# Altium schematic sheet TIDA-01485_Page2.SchDoc
size 431 x 279 mm; Date: Not shown in title block; ApprovedBy: Not shown in title block; CheckedBy: Not shown in title block; Author: Not shown in title block; CompanyName: Not shown in title block; DrawnBy: Manu; Engineer: Not shown in title block; Organization: Not shown in title block; Address1: Not shown in title block; Address2: Not shown in title block; Address3: Not shown in title block; Address4: Not shown in title block; DocumentNumber: 1; Revision: Use project parameter SCH_Rev; SheetNumber: 3; SheetTotal: 5; PageSetup: Record=PageOptions|CenterHorizontal=True|CenterVertical=True|PrintScale=1.00|XCorrection=1.00|YCorrection=1.00|PrintKind=0|BorderSize=5000000|LeftOffset=0|BottomOffset=0|Orientation=2|PaperLength=1000|PaperWidth=1000|Scale=100|PaperSource=15|PrintQuality=600|MediaType=1|DitherType=10|PaperKind=Letter|PrintScaleMode=1; CurrentTime: Not shown in title block; CurrentDate: Not shown in title block; Time: Not shown in title block; DocumentFullPathAndName: Not shown in title block; DocumentName: Not shown in title block; ModifiedDate: Not shown in title block; ImagePath: Not shown in title block
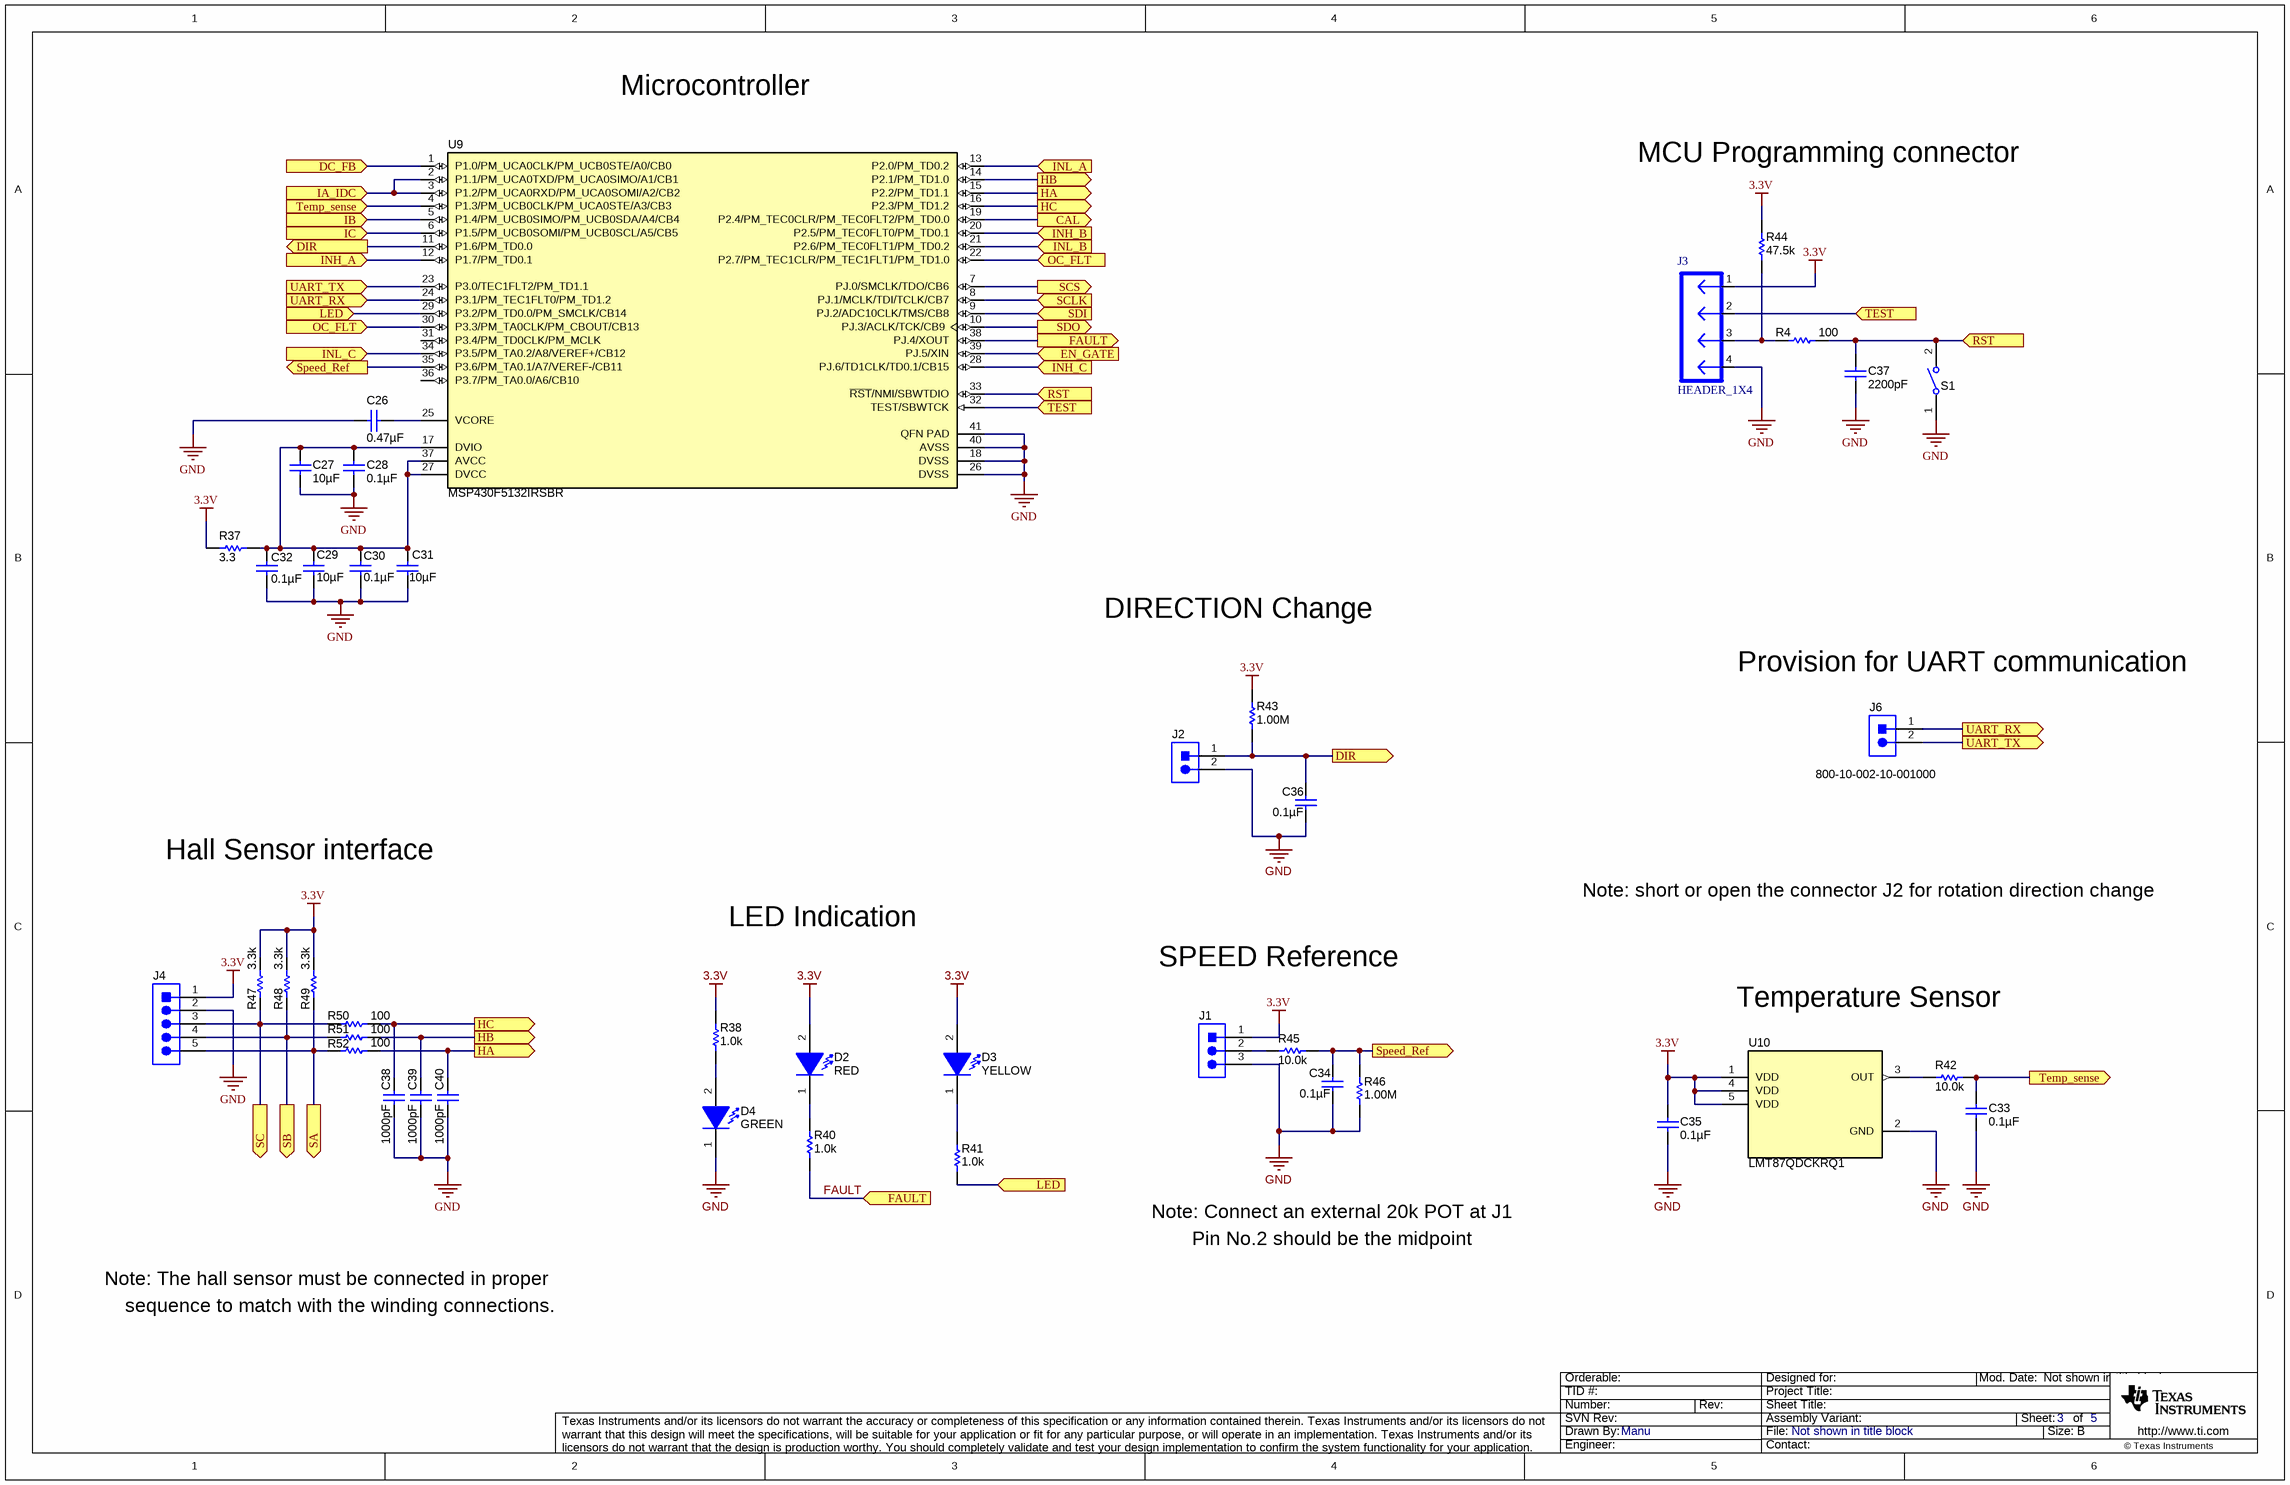
[diagram p0: TIDA-01485_Page2.SchDoc]

## Parts
C26  ValueDisplayed: 0.47µF  [0805_HV]  (hidden comment: C0805C474K4RACTU)
C27  ValueDisplayed: 10µF  [0805_HV]  (hidden comment: 0805YD106MAT2A)
C28  ValueDisplayed: 0.1µF  [0603]  (hidden comment: 0603YC104JAT2A)
C29  ValueDisplayed: 10µF  [0805_HV]  (hidden comment: 0805YD106MAT2A)
C30  ValueDisplayed: 0.1µF  [0603]  (hidden comment: 0603YC104JAT2A)
C31  ValueDisplayed: 10µF  [0805_HV]  (hidden comment: 0805YD106MAT2A)
C32  ValueDisplayed: 0.1µF  [0603]  (hidden comment: 0603YC104JAT2A)
C33  ValueDisplayed: 0.1µF  [0402]  (hidden comment: 885012105016)
C34  ValueDisplayed: 0.1µF  [0402]  (hidden comment: 885012105016)
C35  ValueDisplayed: 0.1µF  [0402]  (hidden comment: 885012105016)
C36  ValueDisplayed: 0.1µF  [0402]  (hidden comment: 885012105016)
C37  ValueDisplayed: 2200pF  [0402]  (hidden comment: GRM155R71H222KA01D)
C38  ValueDisplayed: 1000pF  [0402]  (hidden comment: 885012205061)
C39  ValueDisplayed: 1000pF  [0402]  (hidden comment: 885012205061)
C40  ValueDisplayed: 1000pF  [0402]  (hidden comment: 885012205061)
D2  value RED  [WL-SMCW_GREEN]  (hidden comment: 150060GS75000)
D3  value YELLOW  [WL-SMCW_GREEN]  (hidden comment: 150060GS75000)
D4  value GREEN  [WL-SMCW_GREEN]  (hidden comment: 150060GS75000)
J1  800-10-003-10-001000  [Mill-Max_800-10-003-10-001000]  (value not drawn)
J2  800-10-002-10-001000  [Mill-Max_800-10-002-10-001000]  (value not drawn)
J3  HEADER_1X4  [Mill-Max_800-10-004-10-001000]
J4  800-10-005-10-001000  [Mill-Max_800-10-005-10-001000]  (value not drawn)
J6  800-10-002-10-001000  [Mill-Max_800-10-002-10-001000]
R4  ValueDisplayed: 100  [0402]  (hidden comment: ERJ-2RKF1000X)
R37  ValueDisplayed: 3.3  [0603]  (hidden comment: CRCW06033R30JNEA)
R38  ValueDisplayed: 1.0k  [0603]  (hidden comment: CRCW06031K00JNEA)
R40  ValueDisplayed: 1.0k  [0603]  (hidden comment: CRCW06031K00JNEA)
R41  ValueDisplayed: 1.0k  [0603]  (hidden comment: CRCW06031K00JNEA)
R42  ValueDisplayed: 10.0k  [0402]  (hidden comment: CRCW040210K0FKED)
R43  ValueDisplayed: 1.00M  [0402]  (hidden comment: ERJ-2RKF1004X)
R44  ValueDisplayed: 47.5k  [0402]  (hidden comment: CRCW040247K5FKED)
R45  ValueDisplayed: 10.0k  [0402]  (hidden comment: CRCW040210K0FKED)
R46  ValueDisplayed: 1.00M  [0402]  (hidden comment: ERJ-2RKF1004X)
R47  ValueDisplayed: 3.3k  [0402]  (hidden comment: CRCW04023K30JNED)
R48  ValueDisplayed: 3.3k  [0402]  (hidden comment: CRCW04023K30JNED)
R49  ValueDisplayed: 3.3k  [0402]  (hidden comment: CRCW04023K30JNED)
R50  ValueDisplayed: 100  [0402]  (hidden comment: ERJ-2RKF1000X)
R51  ValueDisplayed: 100  [0402]  (hidden comment: ERJ-2RKF1000X)
R52  ValueDisplayed: 100  [0402]  (hidden comment: ERJ-2RKF1000X)
S1  434121025816  [SW_434121025816]  (value not drawn)
U9  MSP430F5132IRSBR  [RSB0040B]
U10  LMT87QDCKRQ1  [DCK0005A_N]

## Ports
CAL (out), DC_FB (in), DIR (out), EN_GATE (in), FAULT (in), FAULT (out), HA (out), HB (out), HC (out), IA_IDC (in), IB (in), IC (in), INH_A (in), INH_B (in), INH_C (in), INL_A (in), INL_B (in), INL_C (in), LED (in), OC_FLT (in), RST (in), SA (out), SB (out), SC (out), SCLK (in), SCS (out), SDI (in), SDO (out), Speed_Ref (out), Temp_sense (in), Temp_sense (out), TEST (in), UART_RX (in), UART_RX (out), UART_TX (in), UART_TX (out)

## Nets
3.3V: C35.1 D2.2(A) D3.2(A) J1.1 J3.1 J4.1 R37.1 R38.2 R43.1 R44.2 R47.2 R48.2 R49.2 U10.1(VDD) U10.4(VDD) U10.5(VDD)
GND: C26.2 C27.2 C28.2 C29.2 C30.2 C31.2 C32.2 C33.2 C34.2 C35.2 C36.2 C37.2 C38.2 C39.2 C40.2 D4.1(K) J1.3 J2.2 J3.4 J4.2 R46.1 S1.1 U9.18(DVSS) U9.26(DVSS) U9.40(AVSS) U9.41(QFN_PAD) U10.2(GND)
CAL: U9.19(P2.4/PM_TEC0CLR/PM_TEC0FLT2/PM_TD0.0) ; port CAL
DC_FB: U9.1(P1.0/PM_UCA0CLK/PM_UCB0STE/A0/CB0) ; port DC_FB
DIR: C36.1 J2.1 R43.2 U9.11(P1.6/PM_TD0.0) ; port DIR
EN_GATE: U9.39(PJ.5/XIN) ; port EN_GATE
FAULT: R40.1 U9.38(PJ.4/XOUT) ; port FAULT
HA: C40.1 R52.1 U9.15(P2.2/PM_TD1.1) ; port HA
HB: C39.1 R51.1 U9.14(P2.1/PM_TD1.0) ; port HB
HC: C38.1 R50.1 U9.16(P2.3/PM_TD1.2) ; port HC
IA_IDC: U9.2(P1.1/PM_UCA0TXD/PM_UCA0SIMO/A1/CB1) U9.3(P1.2/PM_UCA0RXD/PM_UCA0SOMI/A2/CB2) ; port IA_IDC
IB: U9.5(P1.4/PM_UCB0SIMO/PM_UCB0SDA/A4/CB4) ; port IB
IC: U9.6(P1.5/PM_UCB0SOMI/PM_UCB0SCL/A5/CB5) ; port IC
INH_A: U9.12(P1.7/PM_TD0.1) ; port INH_A
INH_B: U9.20(P2.5/PM_TEC0FLT0/PM_TD0.1) ; port INH_B
INH_C: U9.28(PJ.6/TD1CLK/TD0.1/CB15) ; port INH_C
INL_A: U9.13(P2.0/PM_TD0.2) ; port INL_A
INL_B: U9.21(P2.6/PM_TEC0FLT1/PM_TD0.2) ; port INL_B
INL_C: U9.34(P3.5/PM_TA0.2/A8/VEREF+/CB12) ; port INL_C
LED: R41.1 U9.29(P3.2/PM_TD0.0/PM_SMCLK/CB14) ; port LED
OC_FLT: U9.22(P2.7/PM_TEC1CLR/PM_TEC1FLT1/PM_TD1.0) U9.30(P3.3/PM_TA0CLK/PM_CBOUT/CB13) ; port OC_FLT
RST: C37.1 R4.1 S1.2 U9.33(~{RST}/NMI/SBWTDIO) ; port RST
SA: J4.5 R49.1 R52.2 ; port SA
SB: J4.4 R48.1 R51.2 ; port SB
SC: J4.3 R47.1 R50.2 ; port SC
SCLK: U9.8(PJ.1/MCLK/TDI/TCLK/CB7) ; port SCLK
SCS: U9.7(PJ.0/SMCLK/TDO/CB6) ; port SCS
SDI: U9.9(PJ.2/ADC10CLK/TMS/CB8) ; port SDI
SDO: U9.10(PJ.3/ACLK/TCK/CB9) ; port SDO
Speed_Ref: C34.1 R45.1 R46.2 U9.35(P3.6/PM_TA0.1/A7/VEREF-/CB11) ; port Speed_Ref
Temp_sense: C33.1 R42.1 U9.4(P1.3/PM_UCB0CLK/PM_UCA0STE/A3/CB3) ; port Temp_sense
TEST: J3.2 U9.32(TEST/SBWTCK) ; port TEST
UART_RX: J6.1 U9.24(P3.1/PM_TEC1FLT0/PM_TD1.2) ; port UART_RX
UART_TX: J6.2 U9.23(P3.0/TEC1FLT2/PM_TD1.1) ; port UART_TX
NetC26_1: C26.1 U9.25(VCORE)
NetC27_1: C27.1 C28.1 C29.1 C30.1 C31.1 C32.1 R37.2 U9.17(DVIO) U9.27(DVCC) U9.37(AVCC)
NetD2_1: D2.1(K) R40.2
NetD3_1: D3.1(K) R41.2
NetD4_2: D4.2(A) R38.1
NetJ1_2: J1.2 R45.2
NetJ3_3: J3.3 R4.2 R44.1
NetR42_2: R42.2 U10.3(OUT)

Not connected (* = marked no-connect by the designer): U9 31(P3.4/PM_TD0CLK/PM_MCLK) 36(P3.7/PM_TA0.0/A6/CB10)

## Notes on the sheet
- Microcontroller
- MCU Programming connector
- DIRECTION Change
- (near J6) Provision for UART communication
- Hall Sensor interface
- Note: short or open the connector J2 for rotation direction change
- LED Indication
- SPEED Reference
- Temperature Sensor
- Note: Connect an external 20k POT at J1
- Pin No.2 should be the midpoint
- Note: The hall sensor must be connected in proper
- sequence to match with the winding connections.
- Drawn By:
- SVN Rev:
- Number:
- TID #:
- Orderable:
- Rev:
- Sheet Title:
- File:
- Project Title:
- Designed for:
- Assembly Variant:
- Mod. Date:
- Sheet:
- Size:
- of
- B
- http://www.ti.com
- Texas Instruments and/or its licensors do not warrant the accuracy or completeness of this specification or any information contained therein. Texas Instruments and/or its licensors do not warrant that this design will meet the specifications, will be suitable for your application or fit for any particular purpose, or will operate in an implementation. Texas Instruments and/or its licensors do not warrant that the design is production worthy. You should completely validate and test your design implementation to confirm the system functionality for your application.
- Engineer:
- Contact:
- © Texas Instruments

## Library data of the parts
C26 = C0805C474K4RACTU: CAP, CERM, 0.47 µF, 16 V, +/- 10%, X7R, 0805; Manufacturer: Kemet; Polarized: N; CompType: Capacitor; Value: 0.47uF; U/M: EA; Cap_F: 0.00000047; Tolerance_%: 10; Value1: Unknown; VDC_V: 16; Value2: 16V; TaMin_C: -55; TaMax_C: 125; Cap_Case: 0805; SymbolVersion: 2008-07-09; PartNumber: C0805C474K4RACTU; PackageReference: 0805; RoHS: Y; MountType: SMT; Technology: Ceramic; TempCo: X7R; Published: 2008-06-19; Publisher: Texas Instruments; LatestRevisionDate: 2015-06-13; ComponentLink1Description: Datasheet link; ComponentLink1URL: http://www.kemet.com/docfinder?Partnumber=C0805C474K4RACTU; Supplier 1: Digi-Key; Supplier Part Number 1: 399-8099-1-ND; Supplier 2: Mouser; Supplier Part Number 2: 80-C0805C474K4R; Supplier 3: Farnell; Supplier Part Number 3: 1288279
C27 C29 C31 = 0805YD106MAT2A: CAP, CERM, 10uF, 16V, +/-20%, X5R, 0805; Manufacturer: AVX; Polarized: N; CompType: Capacitor; U/M: EA; Cap_F: 0.00001; Tolerance_%: 20; Value1: Unknown; VDC_V: 16; TaMin_C: -55; TaMax_C: 85; Cap_Case: 0805; SymbolVersion: 2008-07-09; Value: 10uF; PartNumber: 0805YD106MAT2A; PackageReference: 0805; RoHS: Y; Value2: 16V; MountType: SMT; Technology: Ceramic; TempCo: X5R; Published: 2008-06-19; Publisher: Texas Instruments; LatestRevisionDate: 2014-07-08; ComponentLink1Description: Datasheet link; ComponentLink1URL: http://www.avx.com/docs/Catalogs/cx5r.pdf; Supplier 1: Farnell; Supplier Part Number 1: 1582704
C28 C30 C32 = 0603YC104JAT2A: CAP, CERM, 0.1 µF, 16 V, +/- 5%, X7R, 0603; Manufacturer: AVX; Polarized: N; CompType: Capacitor; Value: 0.1uF; U/M: EA; Cap_F: 0.0000001; Tolerance_%: 5; ESR_ohm: 0.039; Value1: 0.039 ohm; VDC_V: 16; Value2: 16V; TaMin_C: -55; TaMax_C: 125; SymbolVersion: 2008-07-09; PartNumber: 0603YC104JAT2A; PackageReference: 0603; RoHS: Y; MountType: SMT; Technology: Ceramic; TempCo: X7R; Cap_Case: 0603; Published: 2008-06-19; Publisher: Texas Instruments; LatestRevisionDate: 2015-06-13; ComponentLink1Description: Datasheet link; ComponentLink1URL: http://www.avx.com/docs/masterpubs/smccp.pdf; Supplier 1: Digi-Key; Supplier Part Number 1: 478-3726-1-ND; Supplier 2: Mouser; Supplier Part Number 2: 581-0603YC104J; Supplier 3: Farnell; Supplier Part Number 3: 1740612
C33-C36 = 885012105016: CAP, CERM, 0.1 µF, 16 V, +/- 20%, X5R, 0402; Manufacturer: Wurth Elektronik; Polarized: N; CompType: Capacitor; Value: 0.1uF; U/M: EA; Cap_F: 0.0000001; Tolerance_%: 20; Value1: Unknown; VDC_V: 16; Value2: 16V; TaMin_C: -55; TaMax_C: 85; AEC Category: Q200; SymbolVersion: 2008-07-09; PartNumber: 885012105016; PackageReference: 0402; RoHS: Y; MountType: SMT; Technology: Ceramic; TempCo: X5R; Cap_Case: 0402; Published: 2008-06-19; Publisher: Texas Instruments; ComponentLink1Description: Datasheet link; ComponentLink1URL: http://katalog.we-online.de/pbs/datasheet/885012105016.pdf; Supplier 1: Mouser; Supplier Part Number 1: 710-885012105016; Supplier 2: Newark; Supplier Part Number 2: 40Y4445; AEC Qualified: N; AEC Grade: N/A
  C33 C34 C36: LatestRevisionDate: 2016-01-15
  C35: LatestRevisionDate: 2016-01-22
C37 = GRM155R71H222KA01D: CAP, CERM, 2200 pF, 50 V, +/- 10%, X7R, 0402; Manufacturer: MuRata; Polarized: N; CompType: Capacitor; Value: 2200pF; U/M: EA; Cap_F: 0.0000000022; Tolerance_%: 10; Value1: Unknown; VDC_V: 50; Value2: 50V; TaMin_C: -55; TaMax_C: 125; AEC Category: Q200; SymbolVersion: 2008-07-09; PartNumber: GRM155R71H222KA01D; PackageReference: 0402; RoHS: Y; MountType: SMT; Technology: Ceramic; TempCo: X7R; Cap_Case: 0402; Published: 2008-06-19; Publisher: Texas Instruments; LatestRevisionDate: 2016-01-08; ComponentLink1Description: Datasheet link; ComponentLink1URL: http://search.murata.co.jp/Ceramy/PnsearchViewAction.do?HnOFG=ON&HnNFG=ON&SEL_CNT=50&sLang=en&sKey=GRM155R71H222KA01D&x=9&y=9&search=startwith; Supplier 1: Digi-Key; Supplier Part Number 1: 490-1305-1-ND; Supplier 2: Mouser; Supplier Part Number 2: 81-GRM36X222K50; Supplier 3: Farnell; Supplier Part Number 3: 1828884; AEC Qualified: ?
C38-C40 = 885012205061: CAP, CERM, 1000 pF, 50 V, +/- 10%, X7R, 0402; Manufacturer: Wurth Elektronik; Polarized: N; CompType: Capacitor; Value: 1000pF; U/M: EA; Cap_F: 0.000000001; Tolerance_%: 10; Value1: Unknown; VDC_V: 50; Value2: 50V; TaMin_C: -55; TaMax_C: 125; AEC Category: Q200; SymbolVersion: 2008-07-09; PartNumber: 885012205061; PackageReference: 0402; RoHS: Y; MountType: SMT; Technology: Ceramic; TempCo: X7R; Cap_Case: 0402; Published: 2008-06-19; Publisher: Texas Instruments; LatestRevisionDate: 2016-01-30; ComponentLink1Description: Datasheet link; ComponentLink1URL: http://katalog.we-online.de/pbs/datasheet/885012205061.pdf; Supplier 1: Digi-Key; Supplier Part Number 1: 732-7556-1-ND; Supplier 2: Mouser; Supplier Part Number 2: 710-885012205061; AEC Qualified: N; AEC Grade: N/A
D2 = 150060GS75000: LED RED CLEAR 0603 SMD; Manufacturer: Wurth Elektronics Inc; PartNumber: 150060RS75000; Type: InGaN; Vf_V: 3.2; Value2: 2V; Io_A: 0.02; Tjmax_C: 85; Value1: W; Angle: 140; U/M: EA; CompType: LED; SymbolVersion: 2008-11-06; MountType: SMT; RoHS: Y; PackageReference: LED_0603; Color: Red; Published: 2008-07-11; Publisher: Texas Instruments; ComponentLink1URL: Visible Name Value Type    False ComponentLink1URL http://katalog.we-online.de/led/datasheet/150060GS75000.pdf STRING; ComponentLink1Description: Datasheet link; LatestRevisionDate: 2016-01-08; Supplier 1: Digi-Key; Supplier Part Number 1: 732-4978-1-ND; Supplier 2: Mouser; Supplier Part Number 2: 710-150060GS75000; Supplier 3: Farnell; Supplier Part Number 3: 2322070
D3 = 150060GS75000: LED YELLOW CLEAR 0603 SMD; Manufacturer: Wurth Elektronics Inc; PartNumber: 150060YS75000; Type: InGaN; Vf_V: 2V; Io_A: 0.02; Tjmax_C: 85; Value1: W; Angle: 140; U/M: EA; CompType: LED; SymbolVersion: 2008-11-06; MountType: SMT; RoHS: Y; PackageReference: LED_0603; Value2: 2V; Color: Yellow; Published: 2008-07-11; Publisher: Texas Instruments; ComponentLink1URL: http://katalog.we-online.de/led/datasheet/150060YS75000.pdf; ComponentLink1Description: Datasheet link; LatestRevisionDate: 2016-01-08; Supplier 1: Digi-Key; Supplier Part Number 1: 732-4981-1-ND; Supplier 2: Mouser; Supplier Part Number 2: 710-150060GS75000; Supplier 3: Farnell; Supplier Part Number 3: 2322070
D4 = 150060GS75000: LED, Green, SMD; Manufacturer: Wurth Elektronics Inc; Type: InGaN; Vf_V: 3.2; Value2: 3.2V; Io_A: 0.02; Tjmax_C: 85; Value1: W; Angle: 140; U/M: EA; CompType: LED; PartNumber: 150060GS75000; SymbolVersion: 2008-11-06; MountType: SMT; RoHS: Y; PackageReference: LED_0603; Color: Green; Published: 2008-07-11; Publisher: Texas Instruments; ComponentLink1URL: http://katalog.we-online.de/led/datasheet/150060GS75000.pdf; ComponentLink1Description: Datasheet link; LatestRevisionDate: 2016-01-08; Supplier 1: Digi-Key; Supplier Part Number 1: 732-4971-1-ND; Supplier 2: Mouser; Supplier Part Number 2: 710-150060GS75000; Supplier 3: Farnell; Supplier Part Number 3: 2322070
J1 = 800-10-003-10-001000: Header, 100mil, 3x1, TH; Manufacturer: Mill-Max; SymbolCreator: a0799628; U/M: EA; SymbolVersion: 2013-03-28; PartNumber: 800-10-003-10-001000; ClassName: Header; PackageReference: Header, 3x1, 100mil, TH; CompType: Header; RoHS: Y; MountType: TH; ComponentLink1Description: Datasheet Link; ComponentLink1URL: http://www.mill-max.com/assets/pdfs/054.PDF; Publisher: Texas Instruments; LatestRevisionDate: 2014-11-22; Supplier 1: Digi-Key; Supplier Part Number 1: ED7203-ND
J2 J6 = 800-10-002-10-001000: Header, 100mil, 2x1, TH; Manufacturer: Mill-Max; SymbolCreator: a0412235; U/M: EA; SymbolVersion: 2013-10-31; PartNumber: 800-10-002-10-001000; PackageReference: Header, 2x1, 100mil, TH; ClassName: Header; CompType: Header; RoHS: Y; MountType: TH; ComponentLink1Description: Datasheet Link; ComponentLink1URL: http://www.mill-max.com/assets/pdfs/054.PDF; Publisher: Texas Instruments; LatestRevisionDate: 2015-01-30; Supplier 1: Digi-Key; Supplier Part Number 1: ED7202-ND
J3 = HEADER_1X4: Header, Male 4-pin, 100mil spacing,; Manufacturer: Sullins; PartNumber: PEC04SAAN; area: 44000; Value: PEC04SAAN; ComponentLink1URL: \\vette02\pmp_pcb\pcad_pdf's\pec36saan.pdf; ComponentHeight: 0.330 inch; SymbolVersion: 05/14/2009 13:15:14; PackageReference: 0.100 inch x 4; ComponentLink1Description: AEO Datasheet Link
J4 = 800-10-005-10-001000: Header, 100mil, 5x1, TH; Manufacturer: Mill-Max; SymbolCreator: a0412235; SymbolVersion: 2013-12-22; PartNumber: 800-10-005-10-001000; PackageReference: Header, 5x1, 100mil, TH; ClassName: Header; CompType: Header; RoHS: Y; MountType: TH; ComponentLink1Description: Datasheet URL; ComponentLink1URL: http://www.mill-max.com/assets/pdfs/054.PDF; Publisher: Texas Instruments; LatestRevisionDate: 2015-12-15; Supplier 1: Digi-Key; Supplier Part Number 1: ED7205-ND
R4 R50-R52 = ERJ-2RKF1000X: RES, 100, 1%, 0.1 W, 0402; Manufacturer: Panasonic; CompType: Resistor; Value: 100; Value_Code: 100R; Tolerance_%: 1; Power_W: 0.1; Value2: 0.1W; VDC_V: 50; TempCo: 100 ppm/C; EIA_Code: E96; U/M: EA; AEC Category: Q200; SymbolVersion: 2009-05-29; PartNumber: ERJ-2RKF1000X; PackageReference: 0402; RoHS: Y; Res_ohm: 100; Value1: 1%; MountType: SMT; Technology: Thick Film; Published: 2008-06-26; Publisher: Texas Instruments; LatestRevisionDate: 2016-01-08; ComponentLink1Description: Datasheet link; ComponentLink1URL: http://industrial.panasonic.com/www-data/pdf/AOA0000/AOA0000CE2.pdf; Supplier 1: Digi-Key; Supplier Part Number 1: P100LCT-ND; Supplier 2: Mouser; Supplier Part Number 2: 667-ERJ-2RKF1000X; Supplier 3: Farnell; Supplier Part Number 3: 2304034; AEC Qualified: ?
R37 = CRCW06033R30JNEA: RES, 3.3, 5%, 0.1 W, 0603; Manufacturer: Vishay-Dale; CompType: Resistor; Value: 3.3; Value_Code: 3R30; Tolerance_%: 5; Power_W: 0.1; Value2: 0.1W; VDC_V: 75; TempCo: 200 ppm/C; EIA_Code: E24; U/M: EA; SizeArea_mm2: 1.28; SizeX_mm: 1.6; SizeY_mm: 0.8; SizeZ_mm: 1; AEC Category: Q200; SymbolVersion: 2009-05-29; PartNumber: CRCW06033R30JNEA; PackageReference: 0603; RoHS: Y; Res_ohm: 3.3; Value1: 5%; MountType: SMT; Technology: Thick Film; Published: 2008-06-26; Publisher: Texas Instruments; LatestRevisionDate: 2016-08-11; ComponentLink1Description: Datasheet link; ComponentLink1URL: http://www.vishay.com/docs/20035/dcrcwe3.pdf; Supplier 1: Digi-Key; Supplier Part Number 1: 541-3.3GCT-ND; Supplier 2: Mouser; Supplier Part Number 2: 71-CRCW0603J-3.3-E3; Supplier 3: Farnell; Supplier Part Number 3: 1514753; AEC Qualified: ?
R38 R40 R41 = CRCW06031K00JNEA: RES, 1.0 k, 5%, 0.1 W, 0603; Manufacturer: Vishay-Dale; CompType: Resistor; Value: 1.0k; Res_ohm: 1000; Value_Code: 1k00; Tolerance_%: 5; Power_W: 0.1; Value2: 0.1W; VDC_V: 75; TempCo: 200 ppm/C; EIA_Code: E24; U/M: EA; AEC Category: Q200; SizeArea_mm2: 1.28; SizeX_mm: 1.6; SizeY_mm: 0.8; SizeZ_mm: 1; SymbolVersion: 2009-05-29; PartNumber: CRCW06031K00JNEA; PackageReference: 0603; RoHS: Y; Value1: 5%; MountType: SMT; Technology: Thick Film; Published: 2008-06-26; Publisher: Texas Instruments; LatestRevisionDate: 2016-08-11; ComponentLink1Description: Datasheet link; ComponentLink1URL: http://www.vishay.com/docs/20035/dcrcwe3.pdf; Supplier 1: Digi-Key; Supplier Part Number 1: 541-1.0KGCT-ND; Supplier 2: Mouser; Supplier Part Number 2: 71-CRCW0603J-1.0K-E3; Supplier 3: Farnell; Supplier Part Number 3: 1652851; AEC Qualified: ?
R42 R45 = CRCW040210K0FKED: RES, 10.0 k, 1%, 0.063 W, 0402; Manufacturer: Vishay-Dale; CompType: Resistor; Value: 10.0k; Res_ohm: 10000; Value_Code: 10k0; Tolerance_%: 1; Power_W: 0.063; Value2: 0.063W; VDC_V: 50; TempCo: 100 ppm/C; EIA_Code: E96; U/M: EA; AEC Category: Q200; SizeArea_mm2: 0.5; SizeZ_mm: 0.6; SymbolVersion: 2009-05-29; PartNumber: CRCW040210K0FKED; PackageReference: 0402; RoHS: Y; Value1: 1%; MountType: SMT; Technology: Thick Film; Published: 2008-06-26; Publisher: Texas Instruments; LatestRevisionDate: 2016-08-08; ComponentLink1Description: Datasheet link; ComponentLink1URL: http://www.vishay.com/docs/20035/dcrcwe3.pdf; Supplier 1: Digi-Key; Supplier Part Number 1: 541-10.0KLCT-ND; Supplier 2: Mouser; Supplier Part Number 2: 71-CRCW0402-10K-E3; Supplier 3: Farnell; Supplier Part Number 3: 1469669; AEC Qualified: ?; SizeX_mm: 1; SizeY_mm: 0.5
R43 R46 = ERJ-2RKF1004X: RES, 1.00 M, 1%, 0.1 W, 0402; Manufacturer: Panasonic; CompType: Resistor; Value: 1.00Meg; Res_ohm: 1000000; Value_Code: 1M00; Tolerance_%: 1; Power_W: 0.1; Value2: 0.1W; VDC_V: 50; TempCo: 100 ppm/C; EIA_Code: E96; U/M: EA; AEC Category: Q200; SymbolVersion: 2009-05-29; PartNumber: ERJ-2RKF1004X; PackageReference: 0402; RoHS: Y; Value1: 1%; MountType: SMT; Technology: Thick Film; Published: 2008-06-26; Publisher: Texas Instruments; LatestRevisionDate: 2016-01-08; ComponentLink1Description: Datasheet link; ComponentLink1URL: http://industrial.panasonic.com/www-data/pdf/AOA0000/AOA0000CE2.pdf; Supplier 1: Digi-Key; Supplier Part Number 1: P1.00MLCT-ND; Supplier 2: Mouser; Supplier Part Number 2: 667-ERJ-2RKF1004X; Supplier 3: Farnell; Supplier Part Number 3: 2304462; AEC Qualified: ?
R44 = CRCW040247K5FKED: RES, 47.5 k, 1%, 0.063 W, 0402; Manufacturer: Vishay-Dale; CompType: Resistor; Value: 47.5k; Res_ohm: 47500; Value_Code: 47k5; Tolerance_%: 1; Power_W: 0.063; Value2: 0.063W; VDC_V: 50; TempCo: 100 ppm/C; EIA_Code: E96; U/M: EA; AEC Category: Q200; SymbolVersion: 2009-05-29; PartNumber: CRCW040247K5FKED; PackageReference: 0402; RoHS: Y; Value1: 1%; MountType: SMT; Technology: Thick Film; Published: 2008-06-26; Publisher: Texas Instruments; LatestRevisionDate: 2016-01-08; ComponentLink1Description: Datasheet link; ComponentLink1URL: http://www.vishay.com/docs/20035/dcrcwe3.pdf; Supplier 1: Digi-Key; Supplier Part Number 1: 541-47.5KLCT-ND; Supplier 2: Mouser; Supplier Part Number 2: 71-CRCW0402-47.5K-E3; Supplier 3: Farnell; Supplier Part Number 3: 1652799; AEC Qualified: ?
R47-R49 = CRCW04023K30JNED: RES, 3.3 k, 5%, 0.063 W, 0402; Manufacturer: Vishay-Dale; CompType: Resistor; Value: 3.3k; Res_ohm: 3300; Value_Code: 3k30; Tolerance_%: 5; Power_W: 0.063; Value2: 0.063W; VDC_V: 50; TempCo: 200 ppm/C; EIA_Code: E24; U/M: EA; AEC Category: Q200; SymbolVersion: 2009-05-29; PartNumber: CRCW04023K30JNED; PackageReference: 0402; RoHS: Y; Value1: 5%; MountType: SMT; Technology: Thick Film; Published: 2008-06-26; Publisher: Texas Instruments; LatestRevisionDate: 2016-01-08; ComponentLink1Description: Datasheet link; ComponentLink1URL: http://www.vishay.com/docs/20035/dcrcwe3.pdf; Supplier 1: Digi-Key; Supplier Part Number 1: 541-3.3KJCT-ND; Supplier 2: Mouser; Supplier Part Number 2: 71-CRCW0402J-3.3K-E3; Supplier 3: Farnell; Supplier Part Number 3: 1514692; AEC Qualified: ?
S1 = 434121025816: Switch, Tactile, SPST, 12 V, SMD; Manufacturer: Wurth Elektronik; SymbolCreator: a0799628; VDC_V: 12; SwitchFunction: Off-On; PositionCount: 1; CurrentRating_mA: 50; SymbolVersion: 2013-06-26; PartNumber: 434121025816; MountType: SMT; ComponentLink1Description: Datasheet URL; ComponentLink1URL: http://katalog.we-online.de/em/datasheet/434121025816.pdf; RoHS: Y; Circuit: SPST; Orientation: Top Actuated; CompType: Switch; PackageReference: SMD, 6x3.9mm; Publisher: Texas Instruments; LatestRevisionDate: 2016-09-01; Supplier 1: Farnell; Supplier Part Number 1: 1867991
U9 = MSP430F5132IRSBR: 25 MHz Mixed Signal Microcontroller with 8 KB Flash, 1024 B SRAM and 29 GPIOs, -40 to 85 degC, 40-pin QFN (RSB), Green (RoHS & no Sb/Br); Alternate Manufacturer: Texas Instruments; Alternate PartNumber: Equivalent; ADC: 10-bit SAR; ADC Channels: 8; Brown Out Reset: Yes; DMA: 3; Frequency(MHz): 25; GPIO: 29; Multiplier: 32x32; Pin/Package: 38TSSOP, 40WQFN; SRAM(B): 1024; SubFamily: 5 Series; USCI_A (UART/LIN/IrDA/SPI): 1; DatasheetVersion: SLAS619G; PackageVersion: 4207182/C, 05/2011; PackageReference: RSB0040B; PackageDescription: 40-Pin Plastic Flat Pack, Body 5 x 5 mm, Pitch 0.4mm; Comparators: Yes; Eco-Plan: Green (RoHS & no Sb/Br); Flash(KB): 8; SVS: Yes; Temp Sensor: Yes; Timers - 16-bit: 3; USCI_B (I2C & SPI): 1; Watchdog: Yes; MountType: SMT; ComponentLink1Description: Manufacturer URL; ComponentLink1URL: http://www.ti.com/; ComponentLink2Description: Datasheet; ComponentLink2URL: http://www.ti.com/general/docs/lit/getliterature.tsp?genericPartNumber=MSP430F5132&fileType=pdf; PartNumber: MSP430F5132IRSBR; Manufacturer: Texas Instruments
U10 = LMT87QDCKRQ1: SC70 Analog Temperature Sensor with Class-AB Output, DCK0005A; Alternate PartNumber: LMT87QDCKTQ1; Manufacturer: Texas Instruments; SymbolCreator: a0411947; SizeArea_mm2: 4.2; SizeAreaWB_mm2: 9.3; SizeX_mm: 2.1; SizeY_mm: 2; SizeZ_mm: 1.1; CompType: IC; U/M: EA; SymbolVersion: 2016-5-19; PartNumber: LMT87QDCKRQ1; PackageReference: DCK0005A; PackageDescription: SOT-5; MountType: SMT; ComponentLink1Description: Datasheet Link; ComponentLink1URL: http://www.ti.com/lit/ds/symlink/lmt87.pdf; RoHS: Y; Publisher: Texas Instruments; LatestRevisionDate: 2016-08-24; Alternate Manufacturer: Texas Instruments